# EAGLE schematic carte_bouton (EAGLE 6.5.0)
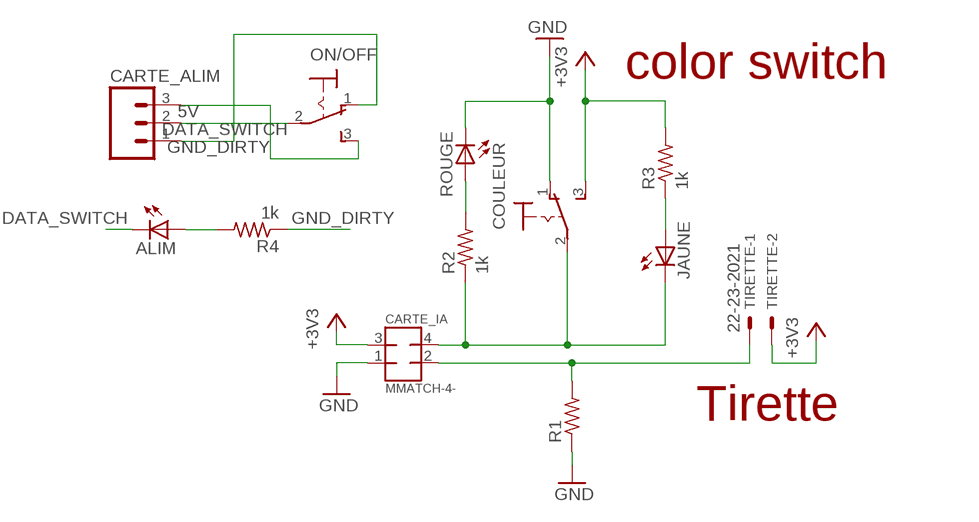
[diagram p0: schematic, sheet 1]

## Parts
ALIM  LEDSML0805  [SML0805]
CARTE_ALIM  M03POLAR  [MOLEX-1X3]
CARTE_IA  MMATCH-4-  [AMP-215079-4]
COULEUR  320-916  [320-916]
JAUNE  LEDSML0805  [SML0805]
ON/OFF  320-916  [320-916]
R1  R-US_R0805  [R0805]
R2  1k  R-US_M0805  [M0805]
R3  1k  R-US_M0805  [M0805]
R4  1k  R-US_M0805  [M0805]
ROUGE  LEDSML0805  [SML0805]
TIRETTE  22-23-2021  [22-23-2021]

## Nets
5V: CARTE_ALIM.3 ON/OFF.3(S)
+3V3: CARTE_IA.3 COULEUR.3(S) R3.2 TIRETTE.2
DATA_SWITCH: ALIM.C CARTE_ALIM.2 ON/OFF.2(P)
GND: CARTE_IA.1 COULEUR.1(O) R1.1 ROUGE.C
GND_DIRTY: CARTE_ALIM.1 ON/OFF.1(O) R4.1
N$1: CARTE_IA.4 COULEUR.2(P) JAUNE.C R2.1
N$2: R2.2 ROUGE.A
N$3: JAUNE.A R3.1
N$9: ALIM.A R4.2
TIRETTE: CARTE_IA.2 R1.2 TIRETTE.1

## Notes on the sheet
- color switch
- Tirette

## Library data of the parts
ALIM JAUNE ROUGE = led:LED: LED OSRAM: - CHIPLED LG R971, LG N971, LY N971, LG Q971, LY Q971, LO R971, LY R971 LH N974, LH R974 LS Q976, LO Q976, LY Q976 LO Q996 - Hyper CHIPLED LW Q18S LB Q993, LB Q99A, LB R99A - SideLED LS A670, LO A670, LY A670, LG A670, LP A670 LB A673, LV A673, LT A673, LW A673 LH A674 LY A675 LS A676, LA A676, LO A676, LY A676, LW A676 LS A679, LY A679, LG A679 - Hyper Micro SIDELED® LS Y876, LA Y876, LO Y876, LY Y876 LT Y87S - SmartLED LW L88C, LW L88S LB L89C, LB L89S, LG L890 LS L89K, LO L89K, LY L89K LS L896, LA L896, LO L896, LY L896 - TOPLED LS T670, LO T670, LY T670, LG T670, LP T670 LSG T670, LSP T670, LSY T670, LOP T670, LYG T670 LG T671, LOG T671, LSG T671 LB T673, LV T673, LT T673, LW T673 LH T674 LS T676, LA T676, LO T676, LY T676, LB T676, LH T676, LSB T676, LW T676 LB T67C, LV T67C, LT T67C, LS T67K, LO T67K, LY T67K, LW E67C LS E67B, LA E67B, LO E67B, LY E67B, LB E67C, LV E67C, LT E67C LW T67C LS T679, LY T679, LG T679 LS T770, LO T770, LY T770, LG T770, LP T770 LB T773, LV T773, LT T773, LW T773 LH T774 LS E675, LA E675, LY E675, LS T675 LS T776, LA T776, LO T776, LY T776, LB T776 LHGB T686 LT T68C, LB T68C - Hyper Mini TOPLED® LB M676 - Mini TOPLED Santana® LG M470 LS M47K, LO M47K, LY M47K Source: http://www.osram.convergy.de LUXEON: - LUMILED® LXK2-PW12-R00, LXK2-PW12-S00, LXK2-PW14-U00, LXK2-PW14-V00 LXK2-PM12-R00, LXK2-PM12-S00, LXK2-PM14-U00 LXK2-PE12-Q00, LXK2-PE12-R00, LXK2-PE12-S00, LXK2-PE14-T00, LXK2-PE14-U00 LXK2-PB12-K00, LXK2-PB12-L00, LXK2-PB12-M00, LXK2-PB14-N00, LXK2-PB14-P00, LXK2-PB14-Q00 LXK2-PR12-L00, LXK2-PR12-M00, LXK2-PR14-Q00, LXK2-PR14-R00 LXK2-PD12-Q00, LXK2-PD12-R00, LXK2-PD12-S00 LXK2-PH12-R00, LXK2-PH12-S00 LXK2-PL12-P00, LXK2-PL12-Q00, LXK2-PL12-R00 Source: www.luxeon.com KINGBRIGHT: KA-3528ASYC Source: www.kingbright.com
CARTE_ALIM = SparkFun-Connectors:M03: Header 3 Standard 3-pin 0.1" header. Use with straight break away headers (SKU : PRT-00116), right angle break away headers (PRT-00553), swiss pins (PRT-00743), machine pins (PRT-00117), and female headers (PRT-00115). Molex polarized connector foot print use with SKU : PRT-08232 with associated crimp pins and housings.
CARTE_IA = jt-con-micromatch:MMATCH-4-*
COULEUR ON/OFF = switch:320-916: TOGGLE SWITCH distributor RS Components
R1-R4 = rcl:R-US_: RESISTOR, American symbol
TIRETTE = con-molex:22-23-2021: .100" (2.54mm) Center Header - 2 Pin; MF: MOLEX; MPN: 22-23-2021; OC_FARNELL: 1462926; OC_NEWARK: 25C3832